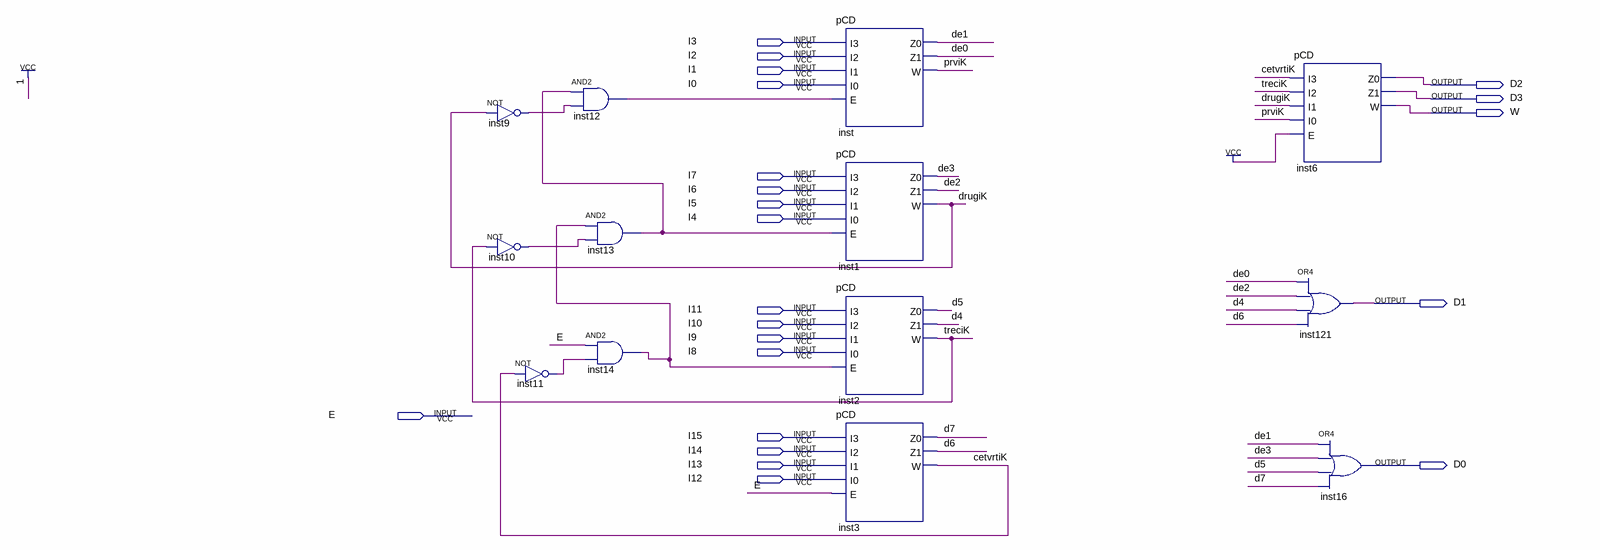
[diagram p0: schematic sheet]
// Quartus schematic PCD16NOVI.bdf as structural Verilog: 13 symbols, 22 pins
module PCD16NOVI (
  input  I3,
  input  I2,
  input  I1,
  input  I0,
  input  I7,
  input  I6,
  input  I5,
  input  I4,
  input  I11,
  input  I10,
  input  I9,
  input  I8,
  input  E,
  input  I15,
  input  I14,
  input  I13,
  input  I12,
  output D2,
  output D3,
  output W,
  output D1,
  output D0
);

  wire cetvrtiK, d4, d5, d6, d7, de0, de1, de2, de3, drugiK, inst9_out, inst10_out, inst11_out, inst12_out,
       inst13_out, inst14_out, prviK, treciK;

  not inst9 (inst9_out, drugiK);
  not inst10 (inst10_out, treciK);
  not inst11 (inst11_out, cetvrtiK);
  and inst12 (inst12_out, inst13_out, inst9_out);
  and inst13 (inst13_out, inst14_out, inst10_out);
  and inst14 (inst14_out, E, inst11_out);
  pCD inst (.I3(I3), .I2(I2), .I1(I1), .I0(I0), .E(inst12_out), .Z0(de1), .Z1(de0), .W(prviK));
  pCD inst1 (.I3(I7), .I2(I6), .I1(I5), .I0(I4), .E(inst13_out), .Z0(de3), .Z1(de2), .W(drugiK));
  pCD inst2 (.I3(I11), .I2(I10), .I1(I9), .I0(I8), .E(inst14_out), .Z0(d5), .Z1(d4), .W(treciK));
  pCD inst3 (.I3(I15), .I2(I14), .I1(I13), .I0(I12), .E(E), .Z0(d7), .Z1(d6), .W(cetvrtiK));
  pCD inst6 (.I3(cetvrtiK), .I2(treciK), .I1(drugiK), .I0(prviK), .E(1'b1), .Z0(D2), .Z1(D3), .W(W));
  or inst121 (D1, de0, de2, d4, d6);
  or inst16 (D0, de1, de3, d5, d7);
endmodule
